# EAGLE design arduether (EAGLE 5.10)
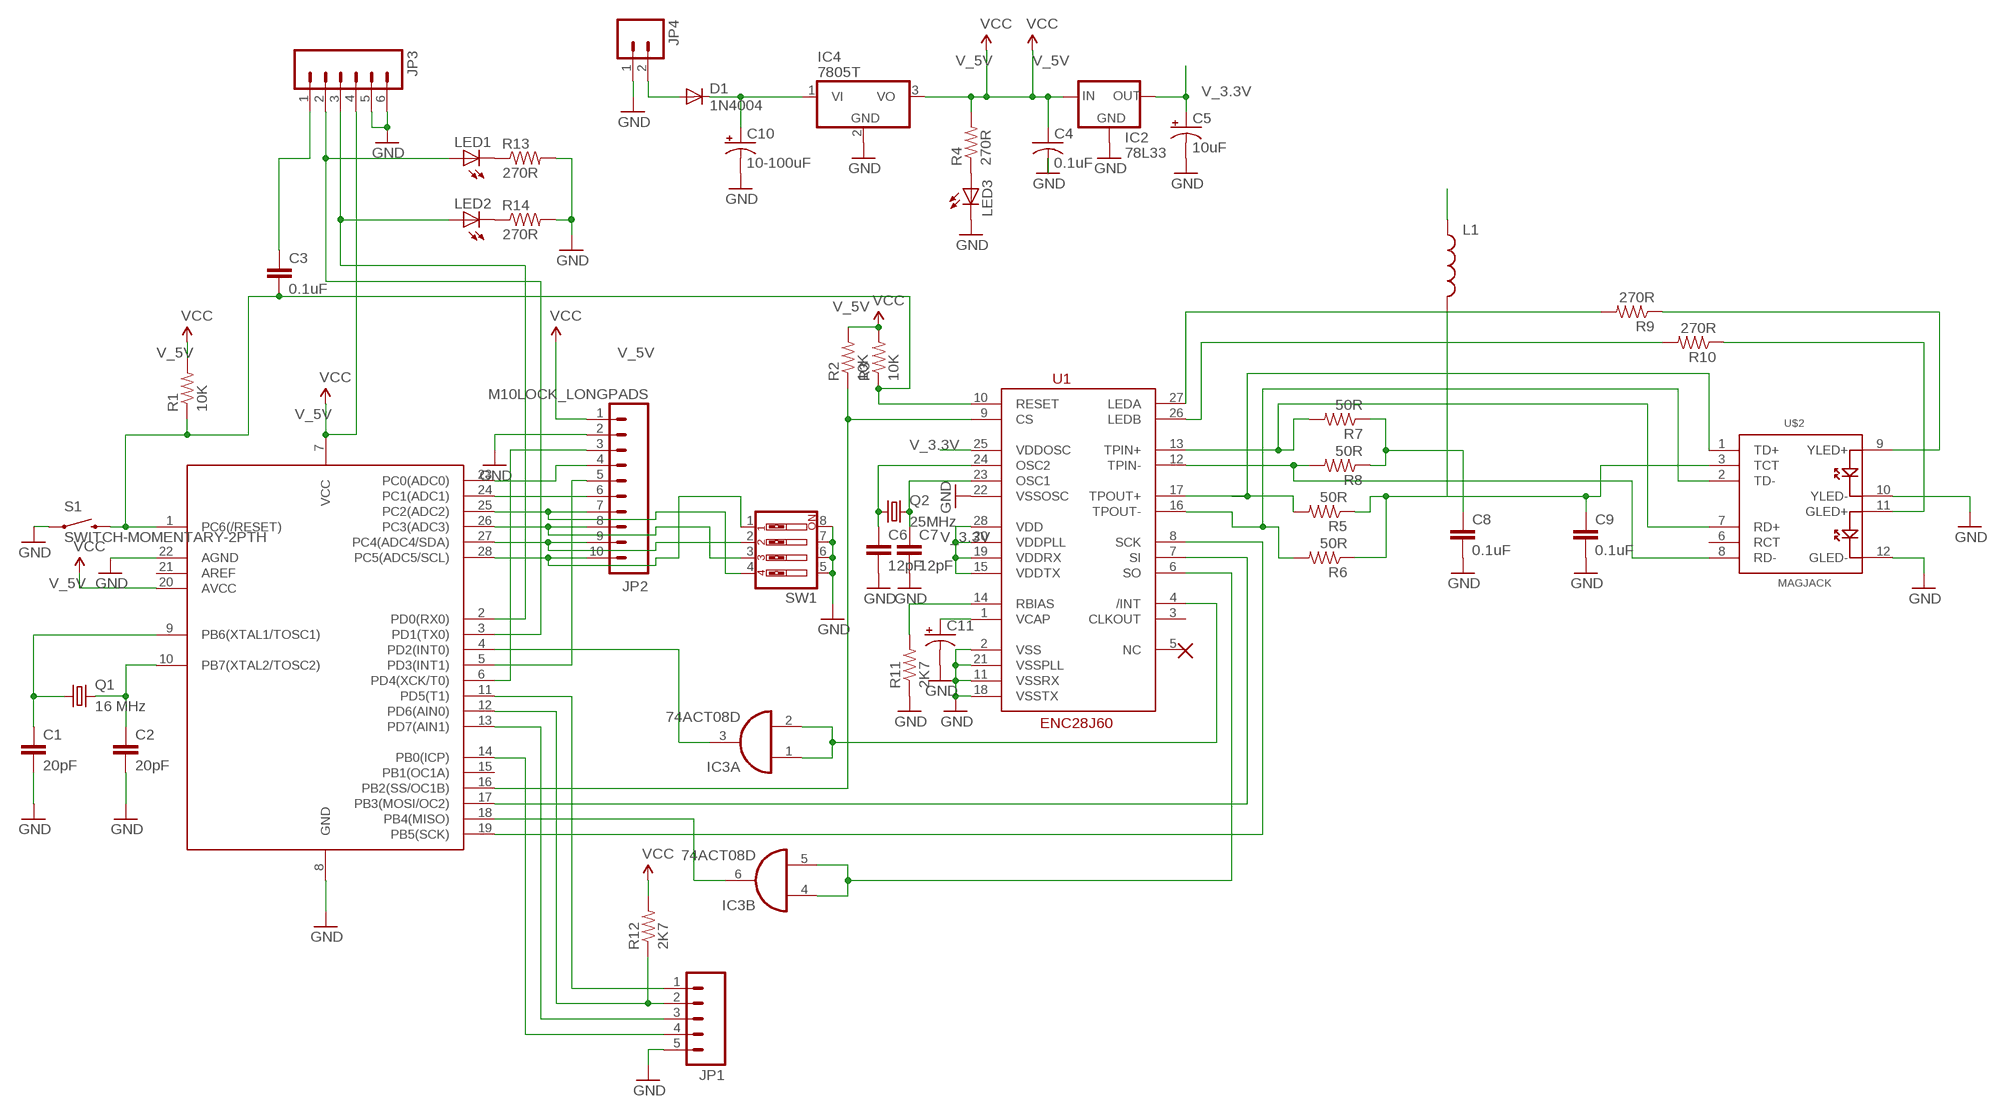
[diagram p0: schematic, sheet 1]

## Parts
C1  20pF  CAPPTH2  [CAP-PTH-SMALL2]
C2  20pF  CAPPTH2  [CAP-PTH-SMALL2]
C3  0.1uF  CAP0805  [0805]
C4  0.1uF  C-USC0805  [C0805]
C5  10uF  CPOL-USSMCA  [SMC_A]
C6  12pF  CAPPTH2  [CAP-PTH-SMALL2]
C7  12pF  CAP0805  [0805]
C8  0.1uF  CAP0805  [0805]
C9  0.1uF  CAP0805  [0805]
C10  10-100uF  CAP_POLPTH1  [CPOL-RADIAL-100UF-25V]
C11  CAP_POL1206  [EIA3216]
D1  1N4004  [DO41-10]
IC2  78L33  MCP1700INLINE  [TO92-INLINE]
IC3  74ACT08D  [SO14]
IC4  7805T  [TO220H]
JP1  M05LOCK_LONGPADS  [1X05_LOCK_LONGPADS]
JP2  M10LOCK_LONGPADS  [1X10_LOCK_LONGPADS]
JP3  M06LOCK_LONGPADS  [1X06_LOCK_LONGPADS]
JP4  M02LOCK_LONGPADS  [1X02_LOCK_LONGPADS]
L1  INDUCTOR1210  [1210]
LED1  LED5MM  [LED5MM]
LED2  LED5MM  [LED5MM]
LED3  LED5MM  [LED5MM]
Q1  16 MHz  CRYSTALHC49US  [HC49US]
Q2  25MHz  CRYSTALHC49US  [HC49US]
R1  10K  RESISTORPTH1  [AXIAL-0.3]
R2  10K  RESISTORPTH1  [AXIAL-0.3]
R3  10K  RESISTORPTH1  [AXIAL-0.3]
R4  270R  RESISTORPTH1  [AXIAL-0.3]
R5  50R  RESISTORPTH1  [AXIAL-0.3]
R6  50R  RESISTORPTH1  [AXIAL-0.3]
R7  50R  RESISTORPTH1  [AXIAL-0.3]
R8  50R  RESISTORPTH1  [AXIAL-0.3]
R9  270R  RESISTORPTH1  [AXIAL-0.3]
R10  270R  RESISTORPTH1  [AXIAL-0.3]
R11  2K7  RESISTORPTH1  [AXIAL-0.3]
R12  2K7  RESISTORPTH1  [AXIAL-0.3]
R13  270R  RESISTORPTH1  [AXIAL-0.3]
R14  270R  RESISTORPTH1  [AXIAL-0.3]
S1  SWITCH-MOMENTARY-2PTH  [TACTILE-PTH]
SW1  SW_DIP-4  [EDG-04]
U1  ENC28J60  [DIL28-3]
U$1  ATMEGA328PDIP28  ATMEGA328P  [DIL28-3]
U$2  MAGJACK  [MAGJACK]

## Nets
GND: C1.2 C2.2 C4.2 C5.- C6.2 C7.2 C8.2 C9.2 C10.2(-) C11.C(-) IC2.1(GND) IC4.2(GND) JP1.5 JP2.2 JP3.5 JP3.6 JP4.1 LED3.K(C) R11.P$1 R13.P$2 R14.P$2 S1.1 SW1.5 SW1.6 SW1.7 SW1.8 U1.2(VSS) U1.11(VSSRX) U1.18(VSSTX) U1.21(VSSPLL) U1.22(VSSOSC) U$1.8(GND) U$1.22(AGND) U$2.10(YLED-) U$2.12(GLED-)
N$1: C2.1 Q1.2 U$1.10(PB7(XTAL2/TOSC2))
N$2: C1.1 Q1.1 U$1.9(PB6(XTAL1/TOSC1))
N$3: C3.2 R1.P$1 R3.P$1 S1.3 U1.10(RESET) U$1.1(PC6(/RESET))
N$4: JP2.6 U$1.24(PC1(ADC1))
N$5: JP2.7 SW1.4 U$1.25(PC2(ADC2))
N$6: JP2.8 SW1.3 U$1.26(PC3(ADC3))
N$7: JP2.9 SW1.2 U$1.27(PC4(ADC4/SDA))
N$8: JP2.10 SW1.1 U$1.28(PC5(ADC5/SCL))
N$9: JP2.4 U$1.23(PC0(ADC0))
N$10: C3.1 JP3.1
N$11: JP3.2 LED1.A U$1.3(PD1(TX0))
N$12: JP2.3 U$1.6(PD4(XCK/T0))
N$13: JP2.5 U$1.5(PD3(INT1))
N$14: JP3.3 LED2.A U$1.2(PD0(RX0))
N$15: LED1.K(C) R13.P$1
N$16: LED2.K(C) R14.P$1
N$17: JP1.1 U$1.11(PD5(T1))
N$18: JP1.2 R12.P$1 U$1.12(PD6(AIN0))
N$19: JP1.3 U$1.13(PD7(AIN1))
N$20: JP1.4 U$1.14(PB0(ICP))
N$21: U1.7(SI) U$1.17(PB3(MOSI/OC2))
N$22: U1.8(SCK) U$1.19(PB5(SCK))
N$23: R2.P$1 U1.9(CS) U$1.16(PB2(SS/OC1B))
N$24: IC3.4(B:I0) IC3.5(B:I1) U1.6(SO)
N$25: IC3.6(B:O) U$1.18(PB4(MISO))
N$26: IC3.3(A:O) U$1.4(PD2(INT0))
N$27: R11.P$2 U1.14(RBIAS)
N$28: IC3.1(A:I0) IC3.2(A:I1) U1.4(/INT)
N$29: C7.1 Q2.2 U1.23(OSC1)
N$30: C6.1 Q2.1 U1.24(OSC2)
N$31: D1.A JP4.2
N$32: C10.1(+) D1.C IC4.1(VI)
N$33: R6.P$2 U1.16(TPOUT-) U$2.2(TD-)
N$35: LED3.A R4.P$1
N$36: R5.P$2 U1.17(TPOUT+) U$2.1(TD+)
N$37: R9.P$2 U1.27(LEDA)
N$38: R7.P$2 U1.13(TPIN+) U$2.7(RD+)
N$39: R9.P$1 U$2.9(YLED+)
N$40: C8.1 R7.P$1 R8.P$1
N$41: C9.1 L1.2 R5.P$1 R6.P$1 U$2.3(TCT)
N$42: C11.A(+) U1.1(VCAP)
N$43: R10.P$2 U1.26(LEDB)
N$44: R10.P$1 U$2.11(GLED+)
N$46: R8.P$2 U1.12(TPIN-) U$2.8(RD-)
V_3.3V: C5.+ IC2.3(OUT) L1.1 U1.15(VDDTX) U1.19(VDDRX) U1.20(VDDPLL) U1.25(VDDOSC) U1.28(VDD)
V_5V: C4.1 IC2.2(IN) IC4.3(VO) JP2.1 JP3.4 R1.P$2 R2.P$2 R3.P$2 R4.P$2 R12.P$2 U$1.7(VCC) U$1.20(AVCC) ; supply symbol labelled VCC
Unconnected: IC3.8(C:O) IC3.9(C:I0) IC3.10(C:I1) IC3.11(D:O) IC3.12(D:I0) IC3.13(D:I1) U1.3(CLKOUT) U1.5(NC) U$1.15(PB1(OC1A)) U$1.21(AREF) U$2.6(RCT)

## Power pins joined to a net without a drawn wire
GND: IC3.7(P:GND)
V_5V: IC3.14(P:VCC)

## Library data of the parts
C1 C2 C6 = ideabot:CAP: Capacitor Standard 0603 ceramic capacitor, and 0.1" leaded capacitor.
C3 C7-C9 = SparkFun:CAP: Capacitor Standard 0603 ceramic capacitor, and 0.1" leaded capacitor.
C4 = adafruit:C-US: CAPACITOR, American symbol
C5 = rcl:CPOL-US: POLARIZED CAPACITOR, American symbol
C10 C11 = SparkFun:CAP_POL: Capacitor Polarized These are standard SMD and PTH capacitors. Normally 10uF, 47uF, and 100uF in electrolytic and tantalum varieties. Always verify the external diameter of the through hole cap, it varies with capacity, voltage, and manufacturer. The EIA devices should be standard.
D1 = diode:1N4004: DIODE general purpose rectifier, 1 A
IC2 = adafruit:MCP1700: VOLTAGE REGULATOR
IC3 = 74xx-eu:74*08: Quad 2-input AND gate
IC4 = adafruit:78*: Positive VOLTAGE REGULATOR Added bigger pads to the TO-92 package
JP1 = SparkFun:M05: Header 5 Standard 5-pin 0.1" header. Use with straight break away headers (SKU : PRT-00116), right angle break away headers (PRT-00553), swiss pins (PRT-00743), machine pins (PRT-00117), and female headers (PRT-00115). Molex polarized connector foot print use with SKU : PRT-08230 with associated crimp pins and housings.
JP2 = SparkFun:M10: Header 10 Standard 10-pin 0.1" header. Use with straight break away headers (SKU : PRT-00116), right angle break away headers (PRT-00553), swiss pins (PRT-00743), machine pins (PRT-00117), and female headers (PRT-00115).
JP3 = SparkFun:M06: Header 6 Standard 6-pin 0.1" header. Use with straight break away headers (SKU : PRT-00116), right angle break away headers (PRT-00553), swiss pins (PRT-00743), machine pins (PRT-00117), and female headers (PRT-00115). Molex polarized connector foot print use with SKU : PRT-08094 with associated crimp pins and housings. NOTES ON THE VARIANTS LOCK and LOCK_LONGPADS... This footprint was designed to help hold the alignment of a through-hole component (i.e. 6-pin header) while soldering it into place. You may notice that each hole has been shifted either up or down by 0.005 of an inch from it's more standard position (which is a perfectly straight line). This slight alteration caused the pins (the squares in the middle) to touch the edges of the holes. Because they are alternating, it causes a "brace" to hold the component in place. 0.005 has proven to be the perfect amount of "off-center" position when using our standard breakaway headers. Although looks a little odd when you look at the bare footprint, once you have a header in there, the alteration is very hard to notice. Also, if you push a header all the way into place, it is covered up entirely on the bottom side. This idea of altering the position of holes to aid alignment will be further integrated into the Sparkfun Library for other footprints. It can help hold any component with 3 or more connection pins.
JP4 = SparkFun:M02: Header 2 Standard 2-pin 0.1" header. Use with straight break away headers (SKU : PRT-00116), right angle break away headers (PRT-00553), swiss pins (PRT-00743), machine pins (PRT-00117), and female headers (PRT-00115). Molex polarized connector foot print use with SKU : PRT-08233 with associated crimp pins and housings.
L1 = SparkFun:INDUCTOR: Inductors Basic Inductor/Choke - 0603 and 1206. Footprints are not proven and vary greatly between part numbers.
LED1-LED3 = led:LED: LED OSRAM: - CHIPLED LG R971, LG N971, LY N971, LG Q971, LY Q971, LO R971, LY R971 LH N974, LH R974 LS Q976, LO Q976, LY Q976 LO Q996 - Hyper CHIPLED LW Q18S LB Q993, LB Q99A, LB R99A - SideLED LS A670, LO A670, LY A670, LG A670, LP A670 LB A673, LV A673, LT A673, LW A673 LH A674 LY A675 LS A676, LA A676, LO A676, LY A676, LW A676 LS A679, LY A679, LG A679 - Hyper Micro SIDELED® LS Y876, LA Y876, LO Y876, LY Y876 LT Y87S - SmartLED LW L88C, LW L88S LB L89C, LB L89S, LG L890 LS L89K, LO L89K, LY L89K LS L896, LA L896, LO L896, LY L896 - TOPLED LS T670, LO T670, LY T670, LG T670, LP T670 LSG T670, LSP T670, LSY T670, LOP T670, LYG T670 LG T671, LOG T671, LSG T671 LB T673, LV T673, LT T673, LW T673 LH T674 LS T676, LA T676, LO T676, LY T676, LB T676, LH T676, LSB T676, LW T676 LB T67C, LV T67C, LT T67C, LS T67K, LO T67K, LY T67K, LW E67C LS E67B, LA E67B, LO E67B, LY E67B, LB E67C, LV E67C, LT E67C LW T67C LS T679, LY T679, LG T679 LS T770, LO T770, LY T770, LG T770, LP T770 LB T773, LV T773, LT T773, LW T773 LH T774 LS E675, LA E675, LY E675, LS T675 LS T776, LA T776, LO T776, LY T776, LB T776 LHGB T686 LT T68C, LB T68C - Hyper Mini TOPLED® LB M676 - Mini TOPLED Santana® LG M470 LS M47K, LO M47K, LY M47K Source: http://www.osram.convergy.de LUXEON: - LUMILED® LXK2-PW12-R00, LXK2-PW12-S00, LXK2-PW14-U00, LXK2-PW14-V00 LXK2-PM12-R00, LXK2-PM12-S00, LXK2-PM14-U00 LXK2-PE12-Q00, LXK2-PE12-R00, LXK2-PE12-S00, LXK2-PE14-T00, LXK2-PE14-U00 LXK2-PB12-K00, LXK2-PB12-L00, LXK2-PB12-M00, LXK2-PB14-N00, LXK2-PB14-P00, LXK2-PB14-Q00 LXK2-PR12-L00, LXK2-PR12-M00, LXK2-PR14-Q00, LXK2-PR14-R00 LXK2-PD12-Q00, LXK2-PD12-R00, LXK2-PD12-S00 LXK2-PH12-R00, LXK2-PH12-S00 LXK2-PL12-P00, LXK2-PL12-Q00, LXK2-PL12-R00 Source: www.luxeon.com KINGBRIGHT: KA-3528ASYC Source: www.kingbright.com
Q1 Q2 = ideabot:CRYSTAL: Crystals Various standard crystals. Proven footprints. Spark Fun Electronics SKU : COM-00534
R1-R14 = SparkFun:RESISTOR: Resistor Basic schematic elements and footprints for 0603, 1206, and PTH 1/10th watt (small) resistors.
S1 = ideabot:SWITCH-MOMENTARY-2
SW1 = special:SW_DIP-4: DIP SWITCH
U1 = ideabot:ENC28J60
U$1 = ideabot:ATMEGA328P
U$2 = SparkFun:MAGJACK

## Board
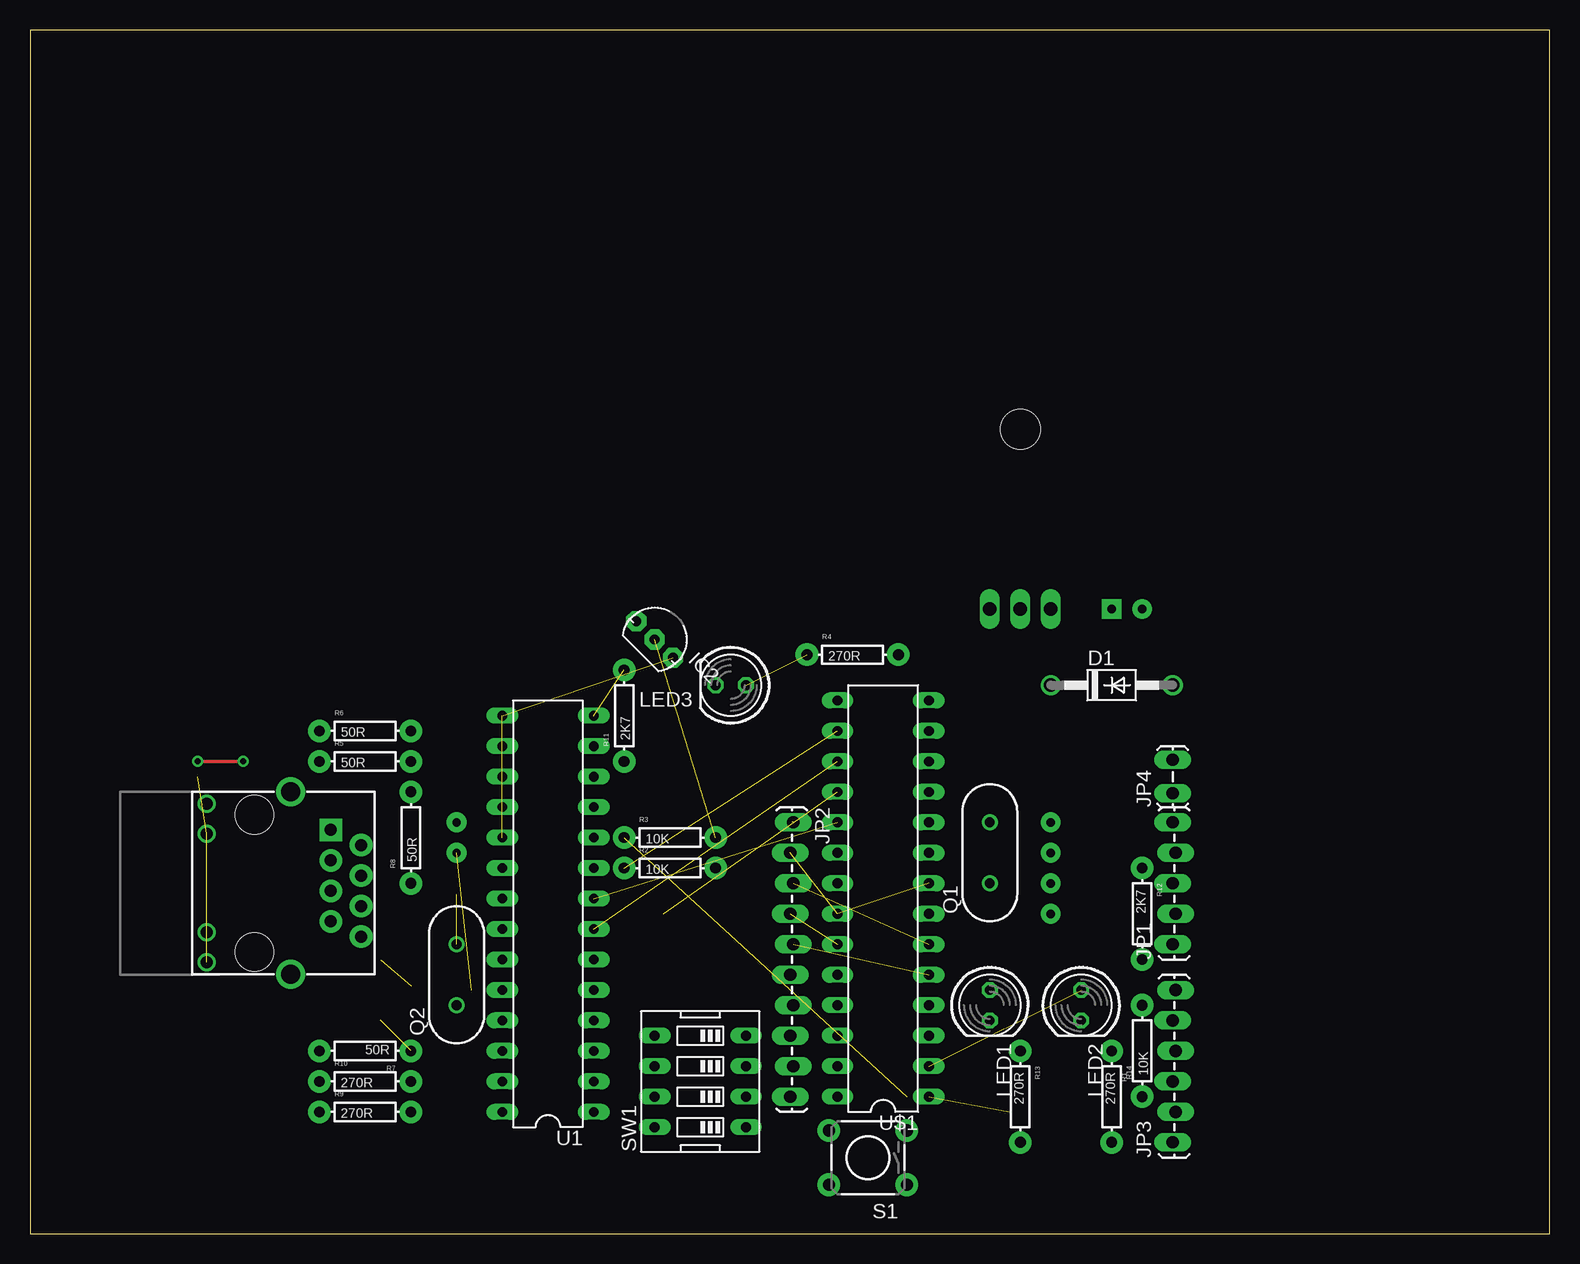
[diagram p1: board, top side]
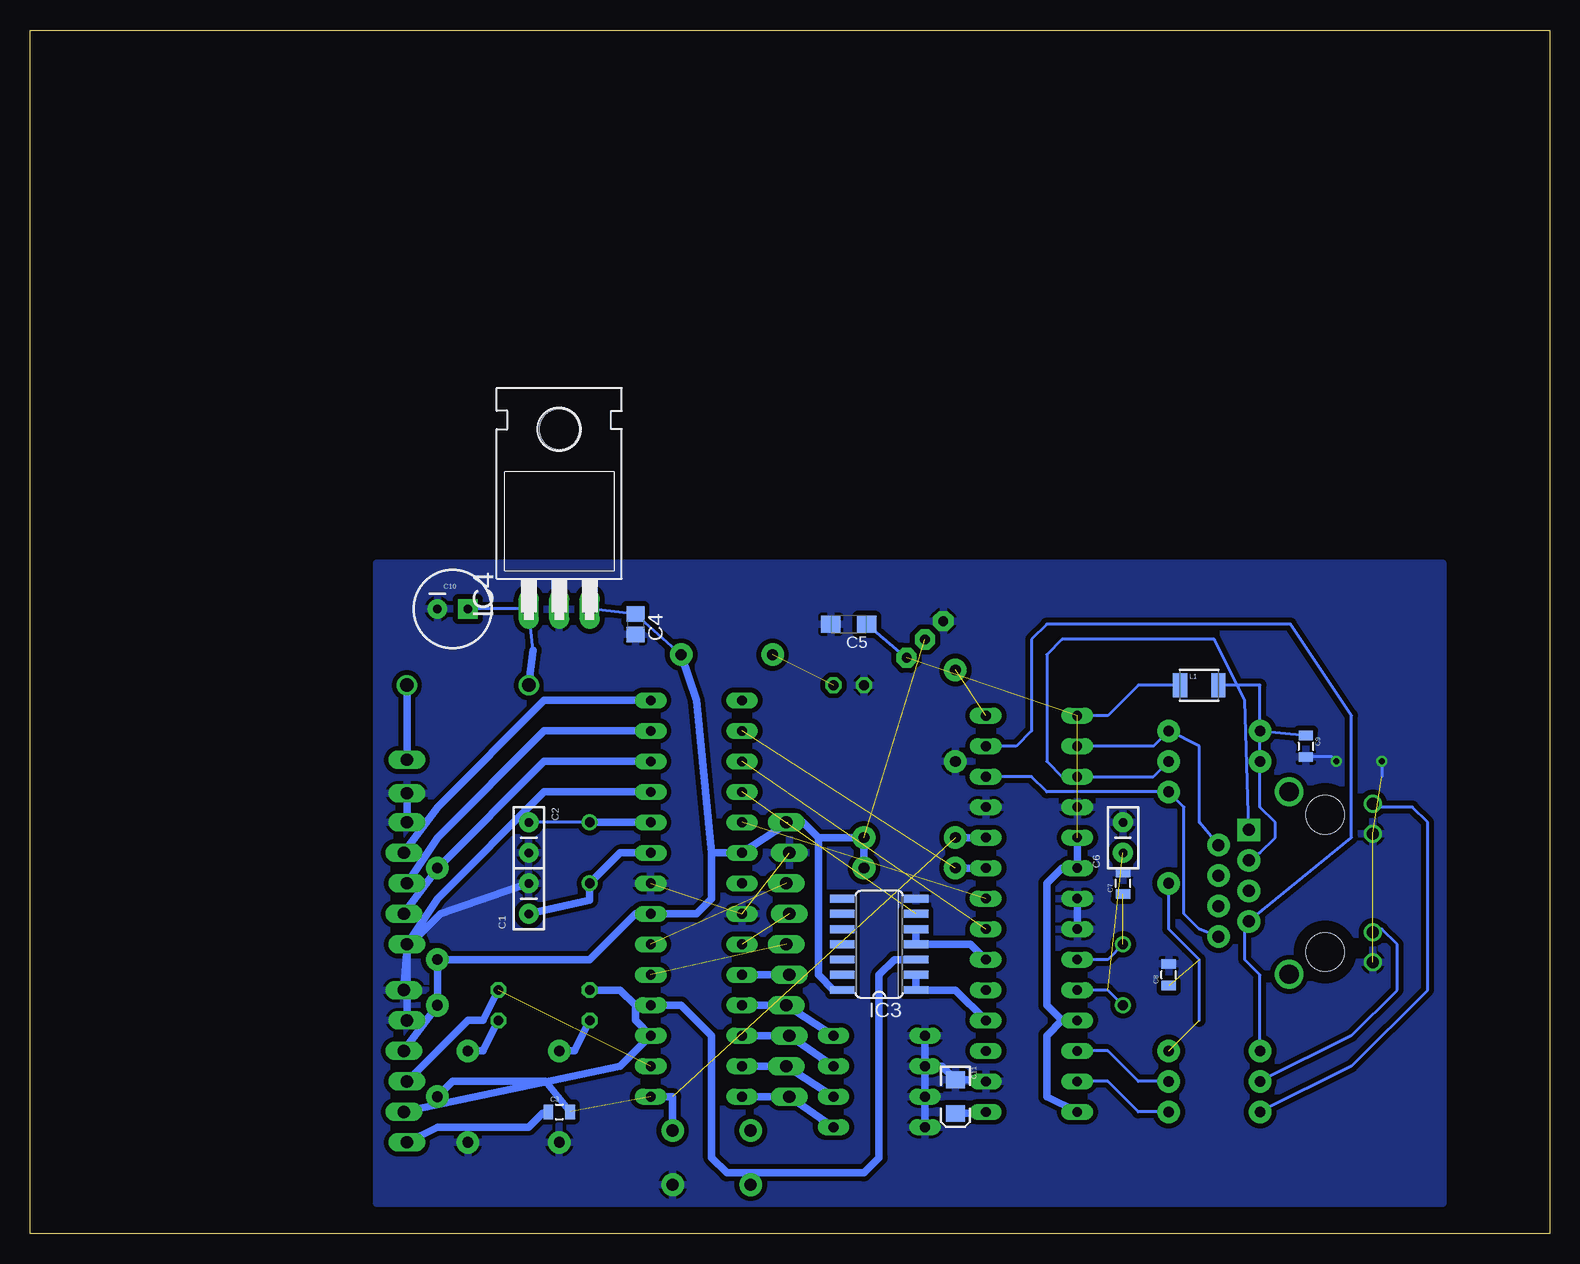
[diagram p2: board, bottom side, seen from below]

Size 126.67 x 100.32 mm. Coordinates in mm from the lower left corner, seen from the top.
Outline: 0,0 126.67,0 126.67,100.32 0,100.32 0,0
Copper layers (1*16): Top 0.035mm / dielectric 1.5mm / Bottom 0.035mm
Design rules "default": minimum track width 10mil, minimum drill 24mil, track to track 8mil, track to pad 8mil, pad to pad 8mil, via to via 8mil, smd to smd 8mil, copper to edge 40mil, drill to drill 8mil, minimum pad ring 10mil, minimum via ring 8mil, stop-mask expansion 4mil, vias tented up to drill 0mil, thermal gap 10mil

### Footprints (pad centres in the part's own frame; a part is rotated, then mirrored left to right if it is on the bottom)
CAP-PTH-SMALL2 = drill 0.7 pad 1.651 round: 1 0,0; 2 2.54,0
0805 = smd 0.8 x 1.2: 1 -0.9,0; 2 0.9,0
C0805 = smd 1.3 x 1.5: 1 -0.85,0; 2 0.85,0
SMC_A = smd 1.6 x 1.4: + -1.5,0; - 1.5,0
CPOL-RADIAL-100UF-25V = drill 0.7 pad 1.651 square: 1 1.27,0 | drill 0.7 pad 1.651 round: 2 -1.27,0
EIA3216 = smd 1.4 x 1.6: A 1.4,0; C -1.4,0
DO41-10 = drill 1.118 round: A 5.08,0; C -5.08,0
TO92-INLINE = drill 0.813 pad 1.676 octagon: 1 -2.159,0; 2 0,0; 3 2.159,0
SO14 = smd 0.66 x 2.032: 1 -3.81,-3.073; 2 -2.54,-3.073; 3 -1.27,-3.073; 4 0,-3.073; 5 1.27,-3.073; 6 2.54,-3.073; 7 3.81,-3.073; 8 3.81,3.073; 9 2.54,3.073; 10 1.27,3.073; 11 0,3.073; 12 -1.27,3.073; 13 -2.54,3.073; 14 -3.81,3.073
TO220H = drill 1.118 long: 1 -2.54,-10.16; 2 0,-10.16; 3 2.54,-10.16 | hole 3.302: 0,4.826
1X05_LOCK_LONGPADS = drill 1.016 long: 1 0,0; 2 2.54,-0.254; 3 5.08,0; 4 7.62,-0.254; 5 10.16,0
1X10_LOCK_LONGPADS = drill 1.016 long: 1 0,0.127; 2 2.54,-0.127; 3 5.08,0.127; 4 7.62,-0.127; 5 10.16,0.127; 6 12.7,-0.127; 7 15.24,0.127; 8 17.78,-0.127; 9 20.32,0.127; 10 22.86,-0.127
1X06_LOCK_LONGPADS = drill 1.016 long: 1 0,0; 2 2.54,-0.254; 3 5.08,0; 4 7.62,-0.254; 5 10.16,0; 6 12.7,-0.254
1X02_LOCK_LONGPADS = drill 1.016 long: 1 -0.127,0; 2 2.667,0
1210 = smd 1.2 x 2: 1 -1.6,0; 2 1.6,0
LED5MM = drill 0.813 octagon: A -1.27,0; K 1.27,0
HC49US = drill 0.813 round: 1 -2.54,0; 2 2.54,0
AXIAL-0.3 = drill 0.9 pad 1.88 round: P$1 -3.81,0; P$2 3.81,0
TACTILE-PTH = drill 1.016 pad 1.88 round: 1 -3.251,2.261; 2 3.251,2.261; 3 -3.251,-2.261; 4 3.251,-2.261
EDG-04 = drill 0.813 long: 1 -3.81,-3.81; 2 -1.27,-3.81; 3 1.27,-3.81; 4 3.81,-3.81; 5 3.81,3.81; 6 1.27,3.81; 7 -1.27,3.81; 8 -3.81,3.81
DIL28-3 = drill 0.813 long: 1 -16.51,-3.81; 2 -13.97,-3.81; 3 -11.43,-3.81; 4 -8.89,-3.81; 5 -6.35,-3.81; 6 -3.81,-3.81; 7 -1.27,-3.81; 8 1.27,-3.81; 9 3.81,-3.81; 10 6.35,-3.81; 11 8.89,-3.81; 12 11.43,-3.81; 13 13.97,-3.81; 14 16.51,-3.81; 15 16.51,3.81; 16 13.97,3.81; 17 11.43,3.81; 18 8.89,3.81; 19 6.35,3.81; 20 3.81,3.81; 21 1.27,3.81; 22 -1.27,3.81; 23 -3.81,3.81; 24 -6.35,3.81; 25 -8.89,3.81; 26 -11.43,3.81; 27 -13.97,3.81; 28 -16.51,3.81
MAGJACK = drill 1 pad 1.88 square: 1 3.175,17.445 | drill 1 pad 1.88 round: 2 4.445,19.985; 3 5.715,17.445; 4 6.985,19.985; 5 8.255,17.445; 6 9.525,19.985; 7 10.795,17.445; 8 12.065,19.985 | drill 1 pad 1.27 round: 9 1,7.1; 10 3.5,7.1; 11 11.7,7.1; 12 14.2,7.1 | drill 1.6 pad 2.184 round: M1 0,14.1; M2 15.2,14.1 | hole 3.2: 1.905,11.095; 13.335,11.095

### Placement (x,y rotation side)
C1  85.09,26.67 90 bottom
C2  85.09,34.29 270 bottom
C3  82.55,10.16 0 bottom
C4  76.2,50.8 270 bottom
C5  58.42,50.8 180 bottom
C6  35.56,31.75 90 bottom
C7  35.56,29.21 90 bottom
C8  31.75,21.59 90 bottom
C9  20.32,40.64 270 bottom
C10  91.44,52.07 0 bottom
C11  49.53,11.43 270 bottom
D1  90.17,45.72 0 top
IC2  52.07,49.53 315 top
IC3  55.88,24.13 90 bottom
IC4  82.55,62.23 0 bottom
JP1  95.25,24.13 90 top
JP2  63.5,34.29 270 top
JP3  95.25,7.62 90 top
JP4  95.25,36.83 90 top
L1  29.21,45.72 0 bottom
LED1  80.01,19.05 270 top
LED2  87.63,19.05 270 top
LED3  58.42,45.72 180 top
Q1  80.01,31.75 90 top
Q2  35.56,21.59 90 top
R1  92.71,15.24 90 top
R2  53.34,30.48 0 top
R3  53.34,33.02 0 top
R4  68.58,48.26 0 top
R5  27.94,39.37 0 top
R6  27.94,41.91 0 top
R7  27.94,15.24 180 top
R8  31.75,33.02 90 top
R9  27.94,10.16 0 top
R10  27.94,12.7 0 top
R11  49.53,43.18 90 top
R12  92.71,26.67 270 top
R13  82.55,11.43 270 top
R14  90.17,11.43 270 top
S1  69.85,6.35 180 top
SW1  55.88,12.7 90 top
U1  43.18,26.67 90 top
U$1  71.12,27.94 90 top
U$2  7.62,36.83 270 top

### Tracks (layer width: path | path; a pad name or v marks a point on that pad's centre or on a via)
GND  (via drill 0.51)  (4 unrouted)
  Top 0.254: v13.97,39.37 v17.78,39.37
  Bottom 0.254: C9.2 18.15,39.74 v17.78,39.37 | v13.97,39.37 13.97,38.1
  Bottom 0.61: U1.22 U1.21 | JP1.5 JP4.1 | 95.25,23.88 JP3.6 | JP3.5 95.25,23.88 | 95.25,23.88 92.46,26.67 C1.2 | U1.2 47.12,12.83 C11.C 50.67,13.97 SW1.6 | SW1.8 SW1.7 SW1.6 | SW1.6 SW1.5
  pour Bottom (isolate 0.406): 8.89,2.54 8.89,55.88 97.79,55.88 97.79,2.54
N$1
  Bottom 0.254: Q1.2 C2.1
  Bottom 0.61: U$1.10 Q1.2
N$2
  Bottom 0.61: C1.1 80.01,27.81 Q1.1 77.47,31.75 U$1.9
N$3  (2 unrouted)
  Bottom 0.61: S1.3 73.1,11.43 U$1.1 | C3.2 83.69,12.7 91.44,12.7 R1.P$1 | U1.10 R3.P$1
N$4
  Bottom 0.61: JP2.6 U$1.24
N$5
  Bottom 0.61: SW1.4 JP2.7 U$1.25
N$6
  Bottom 0.61: SW1.3 JP2.8 U$1.26
N$7
  Bottom 0.61: SW1.2 JP2.9 U$1.27
N$8
  Bottom 0.61: SW1.1 JP2.10 U$1.28
N$9  (1 unrouted)
N$10
  Bottom 0.61: JP3.1 92.71,8.89 85.09,8.89 83.95,10.03 C3.1
N$11
  Bottom 0.61: JP3.2 77.47,13.97 U$1.3 76.2,17.78 76.2,19.05 77.47,20.32 LED1.A
N$12  (1 unrouted)
N$13  (1 unrouted)
  Bottom 0.61: JP2.5 63.5,24.13
N$14  (1 unrouted)
  Bottom 0.61: LED2.A 88.9,17.78 90.17,17.78 JP3.3
N$15
  Bottom 0.61: LED1.K 81.28,15.24 R13.P$1
N$16
  Bottom 0.61: LED2.K 88.9,15.24 R14.P$1
N$17
  Bottom 0.61: U$1.11 83.82,36.83 92.71,27.94 JP1.1
N$18
  Bottom 0.61: U$1.12 83.82,39.37 R12.P$1 JP1.2
N$19
  Bottom 0.61: U$1.13 83.82,41.91 92.71,33.02 JP1.3
N$20
  Bottom 0.61: JP1.4 92.71,35.56 83.82,44.45 U$1.14
N$21  (1 unrouted)
N$22  (1 unrouted)
N$23  (1 unrouted)
  Bottom 0.61: U1.9 R2.P$1
N$24
  Bottom 0.61: U1.6 48.26,24.13 IC3.4 IC3.5
N$25  (1 unrouted)
N$26
  Bottom 0.61: IC3.3 54.61,22.86 55.88,21.59 55.88,6.35 57.15,5.08 68.58,5.08 69.85,6.35 69.85,16.51 72.39,19.05 U$1.4
N$27  (1 unrouted)
N$28
  Bottom 0.61: U1.4 49.53,20.32 IC3.1 IC3.2 52.07,21.59
N$29  (1 unrouted)
  Bottom 0.254: Q2.2 36.83,22.86 U1.23
N$30  (1 unrouted)
  Bottom 0.254: Q2.1 36.83,20.32 U1.24
N$31
  Bottom 0.61: JP4.2 D1.A
N$32
  Bottom 0.254: 84.72,48.63 IC4.1 C10.1
  Bottom 0.61: D1.C 84.72,48.63
N$33
  Bottom 0.254: U1.16 33.02,40.64 R6.P$2 29.21,40.64 29.21,34.29 U$2.2
N$35  (1 unrouted)
N$36
  Bottom 0.254: U$2.1 25.4,44.45 27.94,49.53 40.64,49.53 41.91,48.26 41.91,39.37 40.64,38.1 U1.17 33.02,38.1 R5.P$2
N$37
  Bottom 0.254: R9.P$2 34.29,10.16 36.83,12.7 U1.27
N$38
  Bottom 0.254: R7.P$2 24.13,21.59 25.4,22.86 25.4,25.7 U$2.7 16.51,33.02 16.51,43.18 21.59,50.8 41.91,50.8 43.18,49.53 43.18,41.91 44.45,40.64 U1.13
N$39
  Bottom 0.254: R9.P$1 16.51,13.97 10.16,20.32 10.16,34.29 11.43,35.56 14.45,35.56 U$2.9
N$40  (2 unrouted)
  Bottom 0.254: R8.P$1 31.75,25.4 29.21,22.86 29.21,17.78
N$41
  Bottom 0.254: L1.2 24.13,45.72 R6.P$1 | R6.P$1 C9.1 | R6.P$1 R5.P$1 24.13,35.56 22.86,34.29 22.86,33.02 24.13,31.75 U$2.3
N$42
  Bottom 0.61: U1.1 47.12,10.03 C11.A
N$43
  Bottom 0.254: R10.P$2 34.29,12.7 36.83,15.24 U1.26
N$44
  Bottom 0.254: R10.P$1 16.51,16.51 12.7,20.32 12.7,24.13 13.97,25.4 14.45,25.4 U$2.11
N$46
  Bottom 0.254: U1.12 43.18,38.1 41.91,36.83 R8.P$2 30.48,35.56 30.48,26.67 29.21,25.4 U$2.8
V_3.3V  (2 unrouted)
  Bottom 0.254: L1.1 34.29,45.72 36.83,43.18 U1.15 | IC2.3 C5.+
  Bottom 0.61: U1.28 41.91,11.43 41.91,16.51 40.64,17.78 | 40.64,17.78 U1.25 | 40.64,17.78 41.91,19.05 41.91,29.21 40.64,30.48 U1.20 U1.19
V_5V  (2 unrouted)
  Bottom 0.254: IC4.3 C4.1 R4.P$2
  Bottom 0.61: JP3.4 R1.P$2 R12.P$2 80.01,22.86 76.2,26.67 U$1.7 71.12,26.67 69.85,27.94 69.85,31.75 | IC3.14 59.69,20.32 60.96,21.59 60.96,33.02 | 60.96,33.02 62.23,34.29 63.5,34.29 | 60.96,33.02 R3.P$2 R2.P$2 | R4.P$2 71.12,44.45 69.85,31.75 | 69.85,31.75 U$1.20 63.63,34.16 JP2.1